# EAGLE design BadgeLedMatrix (EAGLE 7.6.0)
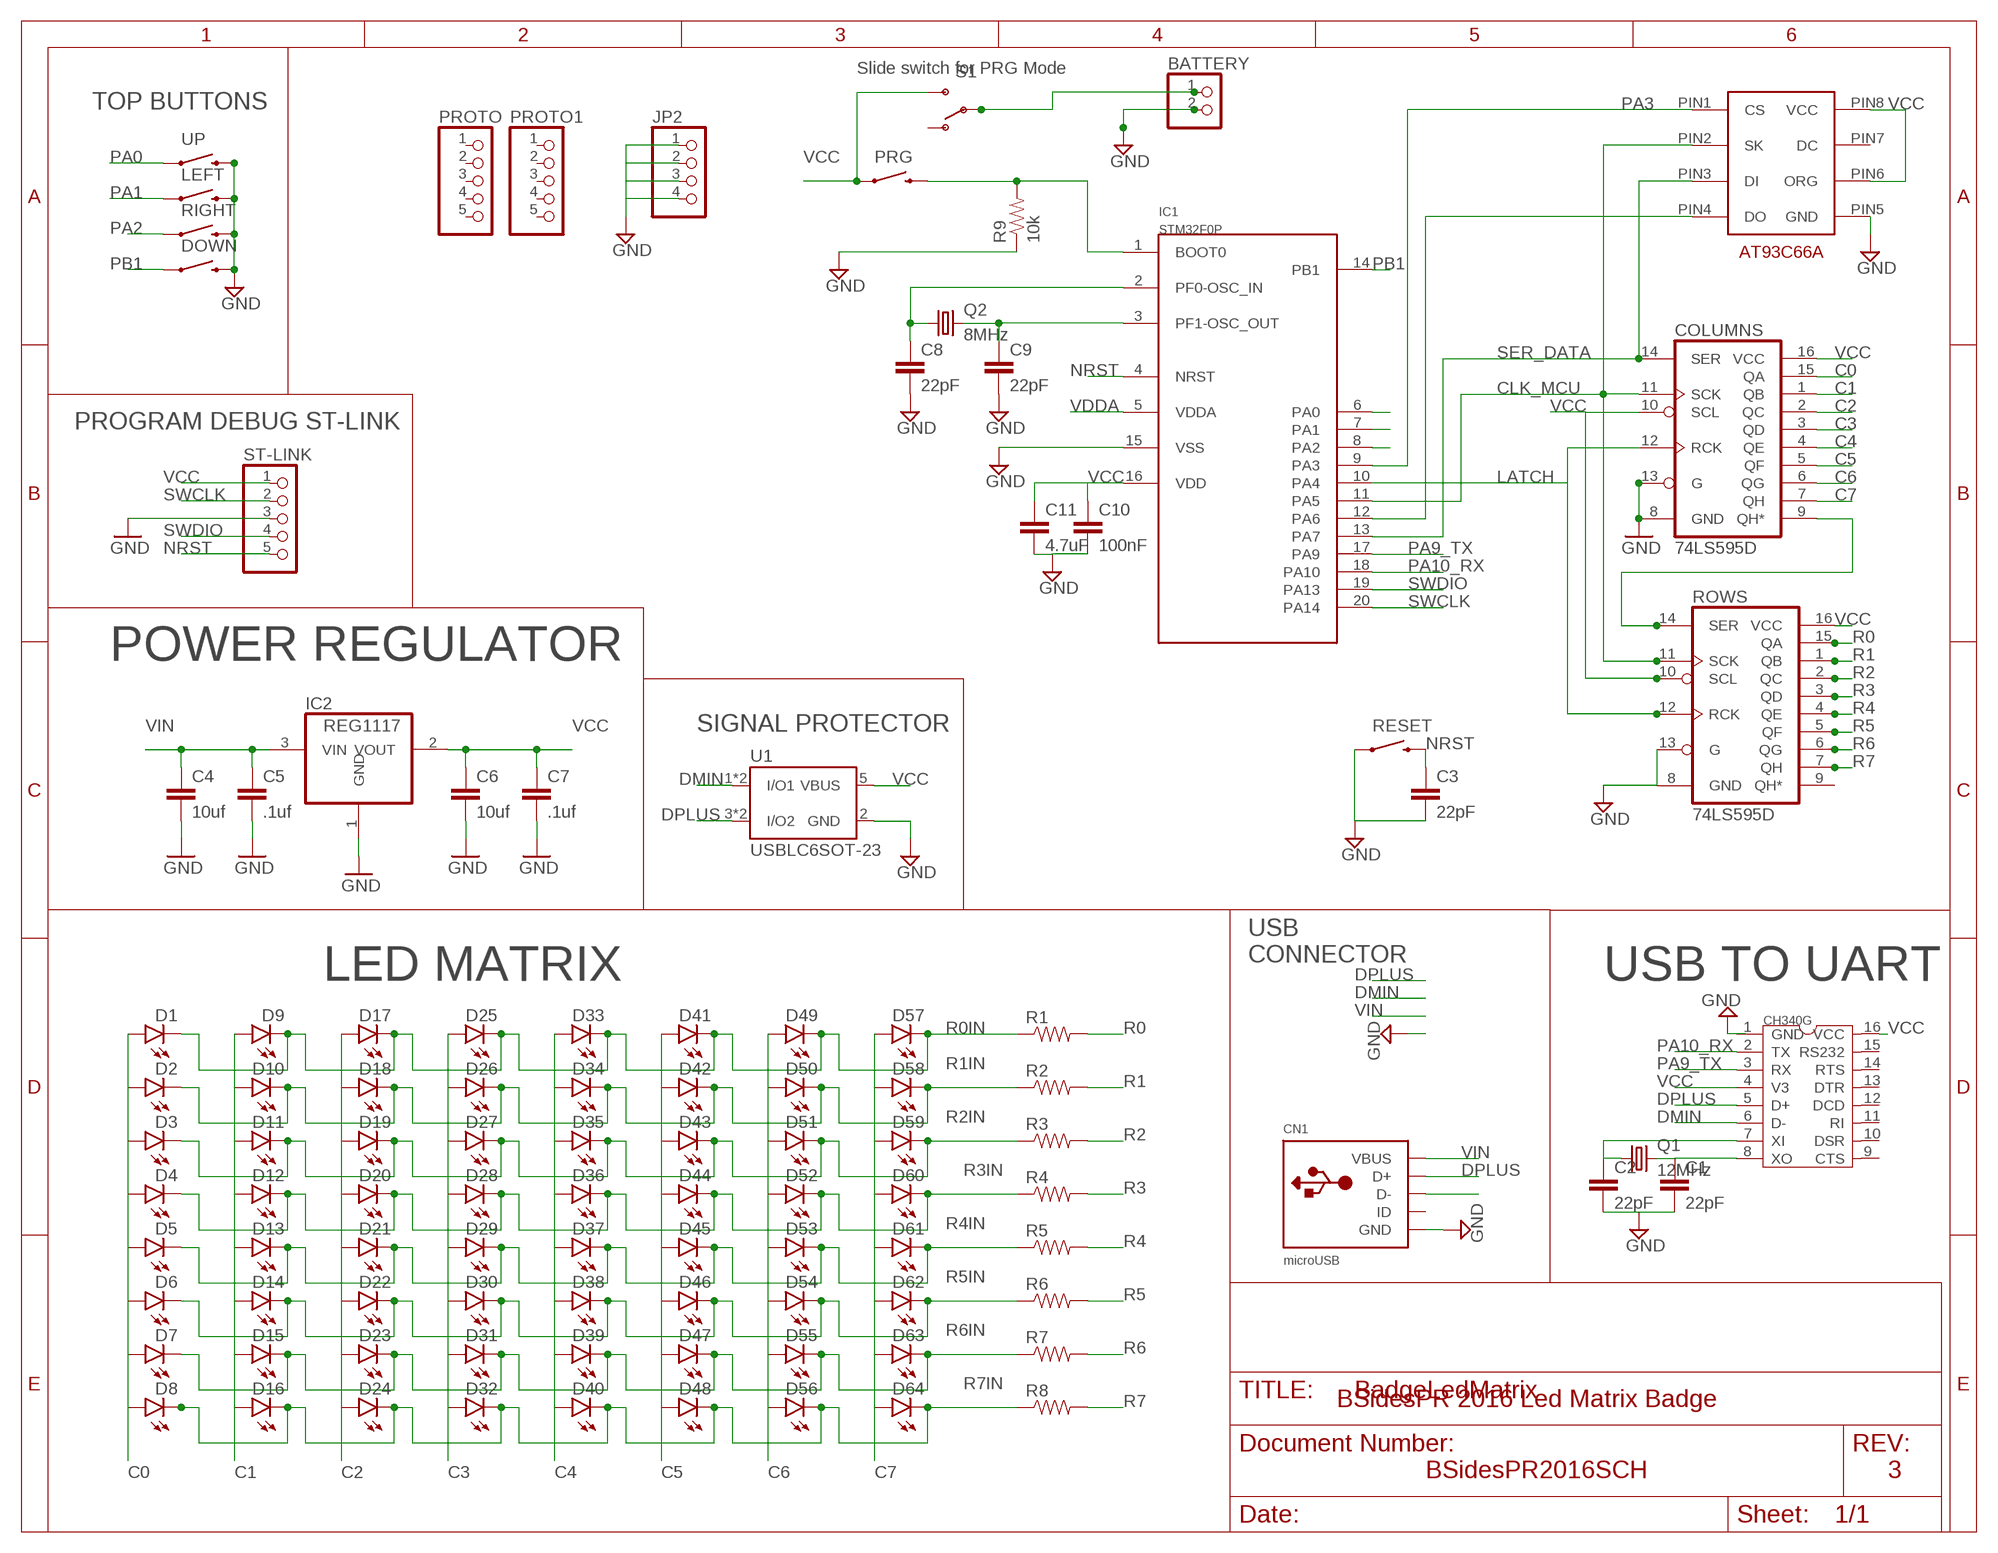
[diagram p0: schematic, sheet 1]

## Parts
BATTERY  PINHD-1X2  [1X02]
C1  22pF  CAP0603-CAP  [0603-CAP]
C2  22pF  CAP0603-CAP  [0603-CAP]
C3  22pF  CAP0603-CAP  [0603-CAP]
C4  10uf  CAP0603-CAP  [0603-CAP]
C5  .1uf  CAP0603-CAP  [0603-CAP]
C6  10uf  CAP0603-CAP  [0603-CAP]
C7  .1uf  CAP0603-CAP  [0603-CAP]
C8  22pF  CAP0603-CAP  [0603-CAP]
C9  22pF  CAP0603-CAP  [0603-CAP]
C10  100nF  CAP0603-CAP  [0603-CAP]
C11  4.7uF  CAP0603-CAP  [0603-CAP]
CH340G  CH340GCH340G  [SOP-16]
CN1  microUSB  USBMICRO_20329  [4UCONN_20329]
COLUMNS  74LS595D  [SO16]
D1  LED0603  [LED-0603]
D2  LED0603  [LED-0603]
D3  LED0603  [LED-0603]
D4  LED0603  [LED-0603]
D5  LED0603  [LED-0603]
D6  LED0603  [LED-0603]
D7  LED0603  [LED-0603]
D8  LED0603  [LED-0603]
D9  LED0603  [LED-0603]
D10  LED0603  [LED-0603]
D11  LED0603  [LED-0603]
D12  LED0603  [LED-0603]
D13  LED0603  [LED-0603]
D14  LED0603  [LED-0603]
D15  LED0603  [LED-0603]
D16  LED0603  [LED-0603]
D17  LED0603  [LED-0603]
D18  LED0603  [LED-0603]
D19  LED0603  [LED-0603]
D20  LED0603  [LED-0603]
D21  LED0603  [LED-0603]
D22  LED0603  [LED-0603]
D23  LED0603  [LED-0603]
D24  LED0603  [LED-0603]
D25  LED0603  [LED-0603]
D26  LED0603  [LED-0603]
D27  LED0603  [LED-0603]
D28  LED0603  [LED-0603]
D29  LED0603  [LED-0603]
D30  LED0603  [LED-0603]
D31  LED0603  [LED-0603]
D32  LED0603  [LED-0603]
D33  LED0603  [LED-0603]
D34  LED0603  [LED-0603]
D35  LED0603  [LED-0603]
D36  LED0603  [LED-0603]
D37  LED0603  [LED-0603]
D38  LED0603  [LED-0603]
D39  LED0603  [LED-0603]
D40  LED0603  [LED-0603]
D41  LED0603  [LED-0603]
D42  LED0603  [LED-0603]
D43  LED0603  [LED-0603]
D44  LED0603  [LED-0603]
D45  LED0603  [LED-0603]
D46  LED0603  [LED-0603]
D47  LED0603  [LED-0603]
D48  LED0603  [LED-0603]
D49  LED0603  [LED-0603]
D50  LED0603  [LED-0603]
D51  LED0603  [LED-0603]
D52  LED0603  [LED-0603]
D53  LED0603  [LED-0603]
D54  LED0603  [LED-0603]
D55  LED0603  [LED-0603]
D56  LED0603  [LED-0603]
D57  LED0603  [LED-0603]
D58  LED0603  [LED-0603]
D59  LED0603  [LED-0603]
D60  LED0603  [LED-0603]
D61  LED0603  [LED-0603]
D62  LED0603  [LED-0603]
D63  LED0603  [LED-0603]
D64  LED0603  [LED-0603]
DOWN  SWITCH-MOMENTARY-2SMD-REDUNDANT  [TACTILE-SWITCH-SMD]
IC1  STM32F0P  [TSSOP20]
IC2  REG1117  [SOT223]
JP2  PINHD-1X4  [1X04]
LEFT  SWITCH-MOMENTARY-2SMD-REDUNDANT  [TACTILE-SWITCH-SMD]
PRG  SWITCH-MOMENTARY-2SMD-REDUNDANT  [TACTILE-SWITCH-SMD]
PROTO  PINHD-1X5  [1X05]
PROTO1  PINHD-1X5  [1X05]
Q1  12MHz  CRYSTALHC49U70  [HC49U70]
Q2  8MHz  CRYSTALHC49U70  [HC49U70]
R1  RESISTOR0603-RES  [0603-RES]
R2  RESISTOR0603-RES  [0603-RES]
R3  RESISTOR0603-RES  [0603-RES]
R4  RESISTOR0603-RES  [0603-RES]
R5  RESISTOR0603-RES  [0603-RES]
R6  RESISTOR0603-RES  [0603-RES]
R7  RESISTOR0603-RES  [0603-RES]
R8  RESISTOR0603-RES  [0603-RES]
R9  10k  RESISTOR0603-RES  [0603-RES]
RESET  SWITCH-MOMENTARY-2SMD-REDUNDANT  [TACTILE-SWITCH-SMD]
RIGHT  SWITCH-MOMENTARY-2SMD-REDUNDANT  [TACTILE-SWITCH-SMD]
ROWS  74LS595D  [SO16]
S1  SWITCH-SPDT-SMD-A  [SWITCH-SPST-SMD-A]
ST-LINK  PINHD-1X5  [1X05]
U1  USBLC6SOT-23  [SOT23-6]
U$6  AT93C66A  [SOP-8]
UP  SWITCH-MOMENTARY-2SMD-REDUNDANT  [TACTILE-SWITCH-SMD]

## Nets
C0: COLUMNS.15(QA) D1.A D2.A D3.A D4.A D5.A D6.A D7.A D8.A
C1: COLUMNS.1(QB) D9.A D10.A D11.A D12.A D13.A D14.A D15.A D16.A
C2: COLUMNS.2(QC) D17.A D18.A D19.A D20.A D21.A D22.A D23.A D24.A
C3: COLUMNS.3(QD) D25.A D26.A D27.A D28.A D29.A D30.A D31.A D32.A
C4: COLUMNS.4(QE) D33.A D34.A D35.A D36.A D37.A D38.A D39.A D40.A
C5: COLUMNS.5(QF) D41.A D42.A D43.A D44.A D45.A D46.A D47.A D48.A
C6: COLUMNS.6(QG) D49.A D50.A D51.A D52.A D53.A D54.A D55.A D56.A
C7: COLUMNS.7(QH) D57.A D58.A D59.A D60.A D61.A D62.A D63.A D64.A
CLK_MCU: COLUMNS.11(SCK) IC1.11(PA5) ROWS.11(SCK) U$6.PIN2(SK)
DMIN: CH340G.6(D-) CN1.D- U1.1(I/O1) U1.4(I/O1)
DPLUS: CH340G.5(D+) CN1.D+ U1.3(I/O2) U1.6(I/O2)
GND: BATTERY.2 C1.2 C2.2 C3.2 C4.2 C5.2 C6.2 C7.2 C8.2 C9.2 C10.2 C11.2 CH340G.1(GND) CN1.BASE@1(GND) CN1.BASE@2(GND) CN1.GND CN1.SPRT@1(GND) CN1.SPRT@2(GND) CN1.SPRT@3(GND) CN1.SPRT@4(GND) COLUMNS.8(GND) COLUMNS.13(G) DOWN.3 DOWN.4 IC1.15(VSS) IC2.1(GND) JP2.1 JP2.2 JP2.3 JP2.4 LEFT.3 LEFT.4 R9.1 RESET.1 RESET.2 RIGHT.3 RIGHT.4 ROWS.8(GND) ROWS.13(G) ST-LINK.3 U1.2(GND) U$6.PIN5(GND) UP.3 UP.4
LATCH: COLUMNS.12(RCK) IC1.10(PA4) ROWS.12(RCK)
N$1: C9.1 IC1.3(PF1-OSC_OUT) Q2.2
N$2: C8.1 IC1.2(PF0-OSC_IN) Q2.1
N$4: IC1.1(BOOT0) PRG.3 PRG.4 R9.2
N$5: BATTERY.1 S1.2(P)
NRST: C3.1 IC1.4(NRST) RESET.3 RESET.4 ST-LINK.5
OVERFLOW: COLUMNS.9(QH*) ROWS.14(SER)
PA0: IC1.6(PA0) UP.1 UP.2
PA1: IC1.7(PA1) LEFT.1 LEFT.2
PA2: IC1.8(PA2) RIGHT.1 RIGHT.2
PA3: IC1.9(PA3) U$6.PIN1(CS)
PA6: IC1.12(PA6) U$6.PIN4(DO)
PA9_TX: CH340G.3(RX) IC1.17(PA9)
PA10_RX: CH340G.2(TX) IC1.18(PA10)
PB1: DOWN.1 DOWN.2 IC1.14(PB1)
R0: R1.2 ROWS.15(QA)
R0IN: D1.C D9.C D17.C D25.C D33.C D41.C D49.C D57.C R1.1
R1: R2.2 ROWS.1(QB)
R1IN: D2.C D10.C D18.C D26.C D34.C D42.C D50.C D58.C R2.1
R2: R3.2 ROWS.2(QC)
R2IN: D3.C D11.C D19.C D27.C D35.C D43.C D51.C D59.C R3.1
R3: R4.2 ROWS.3(QD)
R3IN: D4.C D12.C D20.C D28.C D36.C D44.C D52.C D60.C R4.1
R4: R5.2 ROWS.4(QE)
R4IN: D5.C D13.C D21.C D29.C D37.C D45.C D53.C D61.C R5.1
R5: R6.2 ROWS.5(QF)
R5IN: D6.C D14.C D22.C D30.C D38.C D46.C D54.C D62.C R6.1
R6: R7.2 ROWS.6(QG)
R6IN: D7.C D15.C D23.C D31.C D39.C D47.C D55.C D63.C R7.1
R7: R8.2 ROWS.7(QH)
R7IN: D8.C D16.C D24.C D32.C D40.C D48.C D56.C D64.C R8.1
SER_DATA: COLUMNS.14(SER) IC1.13(PA7) U$6.PIN3(DI)
SWCLK: IC1.20(PA14) ST-LINK.2
SWDIO: IC1.19(PA13) ST-LINK.4
VCC: C6.1 C7.1 C10.1 C11.1 CH340G.4(V3) CH340G.16(VCC) COLUMNS.10(SCL) COLUMNS.16(VCC) IC1.16(VDD) IC2.2(VOUT) PRG.1 PRG.2 ROWS.10(SCL) ROWS.16(VCC) S1.3(S) ST-LINK.1 U1.5(VBUS) U$6.PIN6(ORG) U$6.PIN8(VCC)
VDDA: IC1.5(VDDA)
VIN: C4.1 C5.1 CN1.VBUS IC2.3(VIN)
XI: C2.1 CH340G.7(XI) Q1.1
XO: C1.1 CH340G.8(XO) Q1.2
Unconnected: CH340G.9(CTS) CH340G.10(DSR) CH340G.11(RI) CH340G.12(DCD) CH340G.13(DTR) CH340G.14(RTS) CH340G.15(RS232) CN1.ID PROTO1.1 PROTO1.2 PROTO1.3 PROTO1.4 PROTO1.5 PROTO.1 PROTO.2 PROTO.3 PROTO.4 PROTO.5 ROWS.9(QH*) S1.1(O) U$6.PIN7(DC)

## Notes on the sheet
- Slide switch for PRG Mode
- TOP BUTTONS
- PROGRAM DEBUG ST-LINK
- POWER REGULATOR
- SIGNAL PROTECTOR
- USB
  CONNECTOR
- LED MATRIX | USB TO UART
- BSidesPR 2016 Led Matrix Badge
- BSidesPR2016SCH | 3

## Library data of the parts
BATTERY = pinhead:PINHD-1X2: PIN HEADER
C1-C3 C8-C11 = SparkFun-Capacitors:CAP: Capacitor Standard 0603 ceramic capacitor, and 0.1" leaded capacitor.
C4-C7 = SparkFun-Passives:CAP: Capacitor Standard 0603 ceramic capacitor, and 0.1" leaded capacitor.
CH340G = digital-ic:CH340G: USB to Serial CH340G
CN1 = microbuilder:USB: USB Connectors USBMINIB - Surface Mount Female Mini-B USB Connector 4UConnector: 06564
COLUMNS ROWS = SparkFun-DigitalIC:74*595: 8-bit SHIFT REGISTER, output latch; PROD_ID: IC-07875
D1-D64 = SparkFun-LED:LED: LEDs Standard schematic elements and footprints for 5mm, 3mm, 1206, and 0603 sized LEDs. 5mm - Spark Fun Electronics SKU : COM-00529 (and others)
DOWN LEFT PRG RESET RIGHT UP = SparkFun-Electromechanical:SWITCH-MOMENTARY-2: Various NO switches- pushbuttons, reed, etc
IC1 = digital-ic:STM32F0*: STM32F0
IC2 = burr-brown:REG1117: 800mA and 1A Low Dropout (LDO) Positive Regulator 1.8V, 2.5V, 2.85V, 3.3V, 5V, and Adj; MPN: REG1117; OC_FARNELL: 1097566; OC_NEWARK: 14P6981
JP2 = pinhead:PINHD-1X4: PIN HEADER
PROTO PROTO1 ST-LINK = pinhead:PINHD-1X5: PIN HEADER
Q1 Q2 = crystal:CRYSTAL: CRYSTAL; OC_FARNELL: unknown; OC_NEWARK: unknown
R1-R9 = SparkFun-Passives:RESISTOR: Resistor Basic schematic elements and footprints for 0603, 1206, and PTH resistors.
S1 = SparkFun-Electromechanical:SWITCH-SPDT: SPDT Switch Simple slide switch, Spark Fun Electronics SKU : COM-00102 DPDT SMT slide switch, AYZ0202, SWCH-08179
U1 = digital-ic:USBLC6: USBLC6-2SC6 TVS Diode 5.25VWM 17VC , SOT23-6
U$6 = digital-ic:AT93C66A

## Board
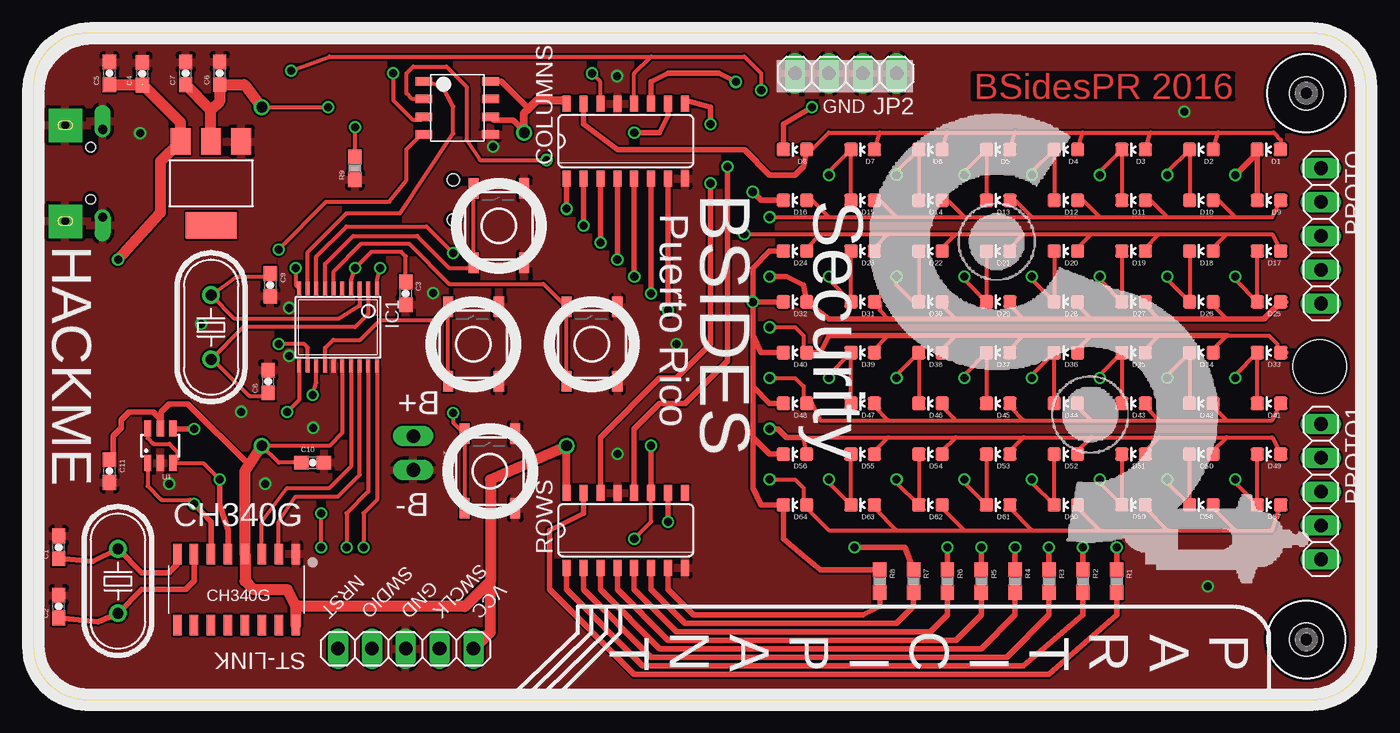
[diagram p1: board, top side]
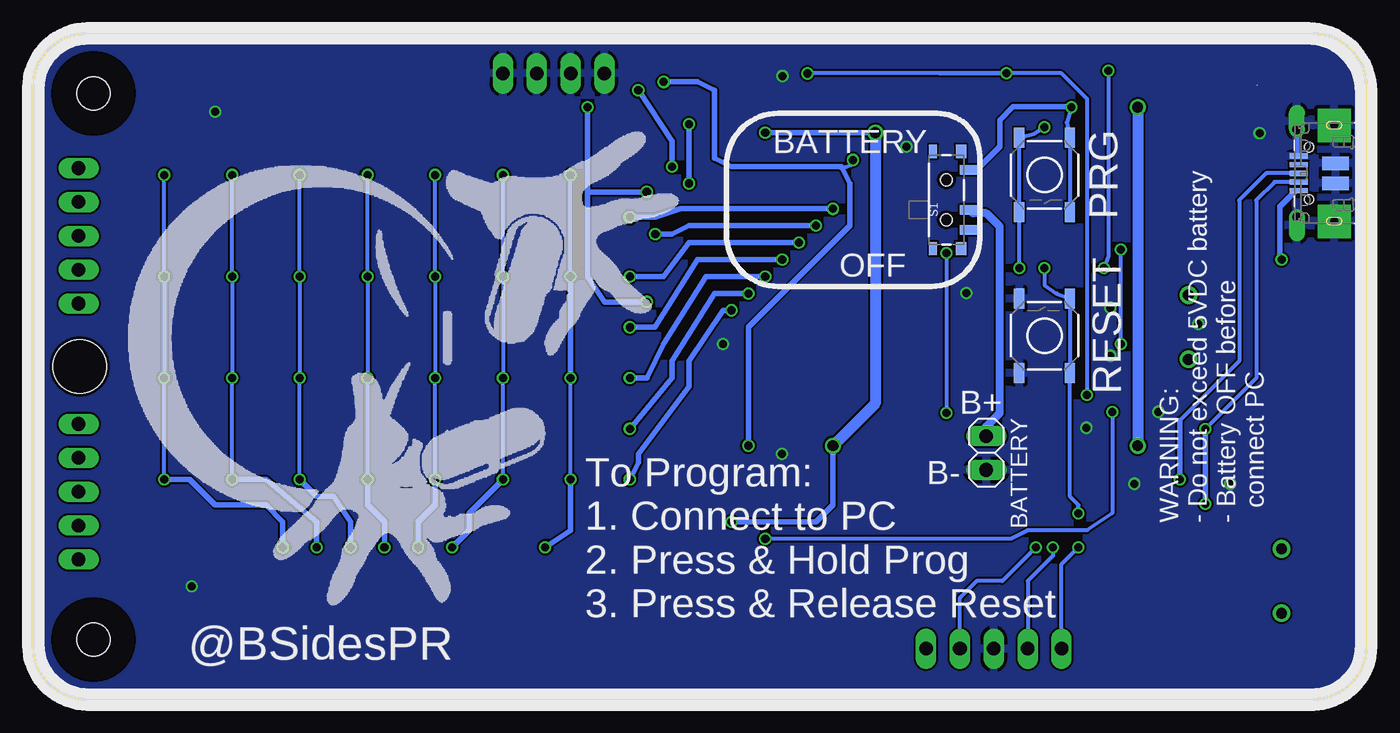
[diagram p2: board, bottom side, seen from below]

Size 100 x 50 mm. Coordinates in mm from the lower left corner, seen from the top.
Outline: 100,46 arc90 96,50 4,50 arc90 0,46 0,4 arc90 4,0 96,0 arc90 100,4 100,46
Copper layers (1*16): Top 0.035mm / dielectric 1.5mm / Bottom 0.035mm
Design rules "SeeedStudio_2layer_DRU_no_angle_20140221": minimum track width 6mil, minimum drill 12mil, track to track 6mil, track to pad 6mil, pad to pad 6mil, via to via 6mil, smd to smd 0mil, copper to edge 10mil, drill to drill 10mil, minimum pad ring 10mil, minimum via ring 6mil, stop-mask expansion 2mil, vias tented up to drill 100mil, thermal gap 10mil
Holes 4 mm at 96.52,25

### Footprints (pad centres in the part's own frame; a part is rotated, then mirrored left to right if it is on the bottom)
1X02 = drill 1.016 long: 1 -1.27,0; 2 1.27,0
0603-CAP = smd 1.1 x 1: 1 -0.85,0; 2 0.85,0
SOP-16 = smd 0.635 x 1.524: 1 -4.445,-2.667; 2 -3.175,-2.667; 3 -1.905,-2.667; 4 -0.635,-2.667; 5 0.635,-2.667; 6 1.905,-2.667; 7 3.175,-2.667; 8 4.445,-2.667; 9 4.445,2.667; 10 3.175,2.667; 11 1.905,2.667; 12 0.635,2.667; 13 -0.635,2.667; 14 -1.905,2.667; 15 -3.175,2.667; 16 -4.445,2.667
4UCONN_20329 = smd 1 x 2: BASE@1 -0.75,-2; BASE@2 0.75,-2 | smd 0.4 x 1.35: D+ 0,0.775; D- -0.65,0.775; GND 1.3,0.775; ID 0.65,0.775; VBUS -1.3,0.775 | drill 0.7 offset: SPRT@1 -3.3,0.9; SPRT@2 3.3,0.9 | drill 0.6 pad 2.5 square: SPRT@3 -3.6,-1.9; SPRT@4 3.6,-1.9 | hole 0.7: -1.95,0; 1.95,0
SO16 = smd 0.6 x 1.2: 1 -4.445,-2.8; 2 -3.175,-2.8; 3 -1.905,-2.8; 4 -0.635,-2.8; 5 0.635,-2.8; 6 1.905,-2.8; 7 3.175,-2.8; 8 4.445,-2.8; 9 4.445,2.8; 10 3.175,2.8; 11 1.905,2.8; 12 0.635,2.8; 13 -0.635,2.8; 14 -1.905,2.8; 15 -3.175,2.8; 16 -4.445,2.8
LED-0603 = smd 1 x 1: A 0,-0.877; C 0,0.877
TACTILE-SWITCH-SMD = smd 1.524 x 0.762: 1 -2.794,1.905; 2 2.794,1.905; 3 -2.794,-1.905; 4 2.794,-1.905
TSSOP20 = smd 0.305 x 0.991: 1 -2.925,-2.918; 2 -2.275,-2.918; 3 -1.625,-2.918; 4 -0.975,-2.918; 5 -0.325,-2.918; 6 0.325,-2.918; 7 0.975,-2.918; 8 1.625,-2.918; 9 2.275,-2.918; 10 2.925,-2.918; 11 2.925,2.918; 12 2.275,2.918; 13 1.625,2.918; 14 0.975,2.918; 15 0.325,2.918; 16 -0.325,2.918; 17 -0.975,2.918; 18 -1.625,2.918; 19 -2.275,2.918; 20 -2.925,2.918
SOT223 = smd 1.499 x 2.007: 1 -2.261,-3.15; 2 0.025,-3.15; 3 2.311,-3.15 | smd 3.81 x 2.007: 4 0,3.15
1X04 = drill 1.016 long: 1 -3.81,0; 2 -1.27,0; 3 1.27,0; 4 3.81,0
1X05 = drill 1.016 long: 1 -5.08,0; 2 -2.54,0; 3 0,0; 4 2.54,0; 5 5.08,0
HC49U70 = drill 0.813: 1 -2.413,0; 2 2.413,0
0603-RES = smd 1.1 x 1: 1 -0.85,0; 2 0.85,0
SWITCH-SPST-SMD-A = smd 0.7 x 1.5: 1 -2.25,-1.75; 2 -0.75,-1.75; 3 2.25,-1.75 | smd 1 x 0.6: GND1 -3.65,1; GND3 3.65,1 | smd 1 x 0.8: GND2 -3.65,-1.1; GND4 3.65,-1.1 | hole 0.9: -1.5,0; 1.5,0
SOT23-6 = smd 0.55 x 1.2: 1 0.95,1.3; 2 0,1.3; 3 -0.95,1.3; 4 -0.95,-1.3; 5 0,-1.3; 6 0.95,-1.3
DRIL-2,5 = hole 2.5: 0,0
SOP-8 = smd 1.27 x 0.635: PIN1 -2.5,2; PIN2 -2.5,0.67; PIN3 -2.5,-0.67; PIN4 -2.5,-2; PIN5 2.5,-2; PIN6 2.5,-0.67; PIN7 2.5,0.67; PIN8 2.5,2

### Placement (x,y rotation side)
BATTERY  28.5,18.5 270 bottom
C1  1.91,11.43 90 top
C2  1.91,6.99 90 top
C3  27.94,30.48 270 top
C4  8.18,46.96 90 top
C5  5.71,46.99 90 top
C6  13.99,47.01 90 top
C7  11.43,46.99 90 top
C8  17.62,23.87 90 top
C9  17.78,31.11 270 top
C10  20.95,17.78 0 top
C11  5.71,17.14 270 top
CH340G  15.24,8.26 180 top
CN1  4.3,39.5 90 bottom
COLUMNS  44.45,41.91 0 top
D1  92.69,41.27 90 top
D2  87.63,41.27 90 top
D3  82.55,41.27 90 top
D4  77.47,41.27 90 top
D5  72.39,41.27 90 top
D6  67.31,41.27 90 top
D7  62.23,41.27 90 top
D8  57.15,41.27 90 top
D9  92.71,37.47 90 top
D10  87.63,37.47 90 top
D11  82.55,37.47 90 top
D12  77.47,37.47 90 top
D13  72.39,37.47 90 top
D14  67.31,37.47 90 top
D15  62.23,37.47 90 top
D16  57.15,37.47 90 top
D17  92.71,33.66 90 top
D18  87.63,33.66 90 top
D19  82.55,33.66 90 top
D20  77.47,33.66 90 top
D21  72.39,33.66 90 top
D22  67.31,33.66 90 top
D23  62.23,33.66 90 top
D24  57.15,33.66 90 top
D25  92.71,29.84 90 top
D26  87.63,29.84 90 top
D27  82.55,29.84 90 top
D28  77.47,29.84 90 top
D29  72.39,29.84 90 top
D30  67.31,29.84 90 top
D31  62.23,29.84 90 top
D32  57.15,29.84 90 top
D33  92.71,26.04 90 top
D34  87.63,26.04 90 top
D35  82.55,26.04 90 top
D36  77.47,26.04 90 top
D37  72.39,26.04 90 top
D38  67.31,26.04 90 top
D39  62.23,26.04 90 top
D40  57.15,26.04 90 top
D41  92.71,22.23 90 top
D42  87.63,22.23 90 top
D43  82.55,22.23 90 top
D44  77.47,22.23 90 top
D45  72.39,22.23 90 top
D46  67.31,22.23 90 top
D47  62.23,22.23 90 top
D48  57.15,22.23 90 top
D49  92.71,18.41 90 top
D50  87.63,18.41 90 top
D51  82.55,18.41 90 top
D52  77.47,18.41 90 top
D53  72.39,18.41 90 top
D54  67.31,18.41 90 top
D55  62.23,18.41 90 top
D56  57.15,18.41 90 top
D57  92.71,14.61 90 top
D58  87.63,14.61 90 top
D59  82.55,14.61 90 top
D60  77.47,14.61 90 top
D61  72.39,14.61 90 top
D62  67.31,14.61 90 top
D63  62.23,14.61 90 top
D64  57.15,14.61 90 top
DOWN  33.02,26.67 90 top
IC1  22.86,27.94 180 top
IC2  13.35,38.73 180 top
JP2  60.96,46.99 180 top
LEFT  34.92,35.56 90 top
PRG  24.13,39.37 270 bottom
PROTO  96.6,34.8 270 top
PROTO1  96.6,15.6 270 top
Q1  6.35,8.89 90 top
Q2  13.34,27.94 90 top
R1  81.28,8.89 270 top
R2  78.74,8.89 270 top
R3  76.2,8.89 270 top
R4  73.66,8.89 270 top
R5  71.12,8.89 270 top
R6  68.58,8.89 270 top
R7  66.04,8.89 270 top
R8  63.5,8.89 270 top
R9  24.13,39.87 90 top
RESET  24.13,27.3 90 bottom
RIGHT  34.25,17.14 90 top
ROWS  44.45,12.7 0 top
S1  31.5,37.5 90 bottom
ST-LINK  27.94,3.81 180 top
U1  9.53,19.05 180 top
U$1  [OBSIDISLOGO_BOTTOM]  51.6,42.6 270 top
U$2  [BSIDES_LOGO_NTB_PIC_ONLY]  63.96,41.41 270 top
U$3  [DRIL-2,5]  95.5,4.5 0 top
U$5  [DRIL-2,5]  95.5,45.5 0 top
U$6  31.8,44.4 0 top
UP  41.91,26.67 90 top

### Tracks (layer width: path | path; a pad name or v marks a point on that pad's centre or on a via)
C0
  Top 0.305: D8.A 58.42,41.27 59.69,42.55 63.5,42.55 | 63.5,42.55 68.58,42.55 | 68.58,42.55 73.66,42.55 | 73.66,42.55 78.74,42.55 | 78.74,42.55 83.82,42.55 | 83.82,42.55 88.9,42.55 | D3.A 83.82,42.55 | D7.A 63.5,42.55 | D6.A 68.58,42.55 | D5.A 73.66,42.55 | D4.A 78.74,42.55 | D2.A 88.9,42.55 | 88.9,42.55 93.06,42.55 93.6,42 93.6,41.31 D1.A
  Top 0.406: D8.A 57.78,40.01 57.15,39.37 55.24,39.37 53.34,41.27 43.81,41.27 41.27,43.18 COLUMNS.15
C1  (via drill 0.61)
  Top 0.305: 59.69,36.2 58.42,36.2 v55.24,36.2 | 59.69,36.2 64.77,36.2 | 64.77,36.2 69.85,36.2 | 69.85,36.2 74.93,36.2 | 74.93,36.2 80.01,36.2 | 80.01,36.2 85.09,36.2 | 85.09,36.2 90.17,36.2 | 90.17,36.2 92.95,36.2 D9.A | D15.A 63.5,37.47 64.77,36.2 | D14.A 68.58,37.47 69.85,36.2 | D13.A 73.66,37.47 74.93,36.2 | D12.A 78.74,37.47 80.01,36.2 | D11.A 83.82,37.47 85.09,36.2 | D10.A 88.9,37.47 90.17,36.2 | D16.A 58.42,37.47 59.69,36.2
  Top 0.406: v40.01,36.83 COLUMNS.1
  Bottom 0.406: v40.01,36.83 51.44,36.83 53.34,36.2 v55.24,36.2
C2  (via drill 0.61)
  Top 0.305: D17.A 92.95,34.92 89.53,34.92 | 79.38,34.92 84.45,34.92 | 84.45,34.92 89.53,34.92 | 59.05,34.92 58.42,34.92 v53.34,34.92 | 59.05,34.92 64.14,34.92 | 64.14,34.92 69.22,34.92 | 69.22,34.92 74.3,34.92 | 74.3,34.92 79.38,34.92 | D20.A 78.35,33.9 79.38,34.92 | D19.A 83.43,33.9 84.45,34.92 | D18.A 88.51,33.9 89.53,34.92 | D23.A 63.11,33.9 64.14,34.92 | D22.A 68.19,33.9 69.22,34.92 | D21.A 73.27,33.9 74.3,34.92 | D24.A 58.03,33.9 59.05,34.92
  Top 0.406: v41.27,35.56 COLUMNS.2
  Bottom 0.406: v41.27,35.56 50.8,35.56 52.07,34.92 v53.34,34.92
C3  (via drill 0.61)
  Top 0.305: D31.A 63.5,29.84 63.5,29.21 64.14,28.57 | 68.58,29.84 D30.A 68.19,29.6 69.22,28.57 | D29.A 73.27,29.6 74.3,28.57 | D28.A 78.35,29.6 79.38,28.57 | D27.A 83.43,29.6 84.45,28.57 | D26.A 88.51,29.6 89.53,28.57
  Top 0.406: v55.24,31.75 56.52,31.75 57.78,31.11 D32.A 59.69,28.57 64.14,28.57 69.22,28.57 74.3,28.57 79.38,28.57 84.45,28.57 89.53,28.57 92.32,28.57 D25.A 93.98,29.84 | v42.55,34.29 COLUMNS.3
  Bottom 0.406: v42.55,34.29 50.8,34.29 52.7,31.75 v55.24,31.75
C4  (via drill 0.61)
  Top 0.305: D39.A 63.11,26.28 64.14,27.3 | D38.A 68.19,26.28 69.22,27.3 | D37.A 73.27,26.28 74.3,27.3 | D36.A 78.35,26.28 79.38,27.3 | D35.A 83.43,26.28 84.45,27.3 | D34.A 88.51,26.28 89.53,27.3 92.71,27.3 93.34,26.67 93.34,26.28 D33.A | v55.24,27.94 57.15,27.94 57.78,27.3 57.78,26.28 D40.A
  Top 0.406: D40.A 59.05,26.04 59.69,27.3 64.14,27.3 69.22,27.3 74.3,27.3 79.38,27.3 84.45,27.3 89.53,27.3 | D33.A 93.98,26.04 | v43.81,33.02 COLUMNS.4
  Bottom 0.406: v43.81,33.02 50.16,33.02 53.34,27.94 v55.24,27.94
C5  (via drill 0.61)
  Top 0.305: 64.14,20.95 59.05,20.95 58.42,22.23 D48.A 57.78,22.47 57.78,23.5 57.15,24.13 v55.24,24.13 | 64.14,20.95 69.22,20.95 | 69.22,20.95 74.3,20.95 | 74.3,20.95 79.38,20.95 | 79.38,20.95 84.45,20.95 | 84.45,20.95 89.53,20.95 | 89.53,20.95 92.95,20.95 D41.A | D47.A 63.11,21.98 64.14,20.95 | D46.A 68.19,21.98 69.22,20.95 | D45.A 73.27,21.98 74.3,20.95 | D44.A 78.35,21.98 79.38,20.95 | D43.A 83.43,21.98 84.45,20.95 | D42.A 88.51,21.98 89.53,20.95
  Top 0.406: v45.09,31.75 COLUMNS.5
  Bottom 0.406: v45.09,31.75 49.53,31.75 52.7,26.67 53.98,24.13 v55.24,24.13
C6  (via drill 0.61)
  Top 0.305: D56.A 57.78,19.68 64.14,19.68 | 64.14,19.68 69.22,19.68 | 69.22,19.68 74.3,19.68 | 74.3,19.68 79.38,19.68 | 79.38,19.68 84.45,19.68 | 84.45,19.68 89.53,19.68 | 89.53,19.68 92.95,19.68 D49.A | D55.A 63.11,18.66 64.14,19.68 | D54.A 68.19,18.66 69.22,19.68 | D53.A 73.27,18.66 74.3,19.68 | D52.A 78.35,18.66 79.38,19.68 | D51.A 83.43,18.66 84.45,19.68 | D50.A 88.51,18.66 89.53,19.68
  Top 0.406: v55.24,20.32 55.88,20.32 56.52,19.68 57.78,19.68 | v46.35,30.48 COLUMNS.6
  Bottom 0.406: v46.35,30.48 48.9,30.48 52.07,25.4 52.07,24.13 v55.24,20.32
C7  (via drill 0.61)
  Top 0.305: 64.77,12.7 69.85,12.7 | 69.85,12.7 74.93,12.7 | 74.93,12.7 80.01,12.7 | 80.01,12.7 85.09,12.7 | 85.09,12.7 90.17,12.7 | 90.17,12.7 92.95,12.7 D57.A | D63.A 63.11,14.36 64.77,12.7 | D62.A 68.19,14.36 69.85,12.7 | D61.A 73.27,14.36 74.93,12.7 | D60.A 78.35,14.36 80.01,12.7 | D59.A 83.43,14.36 85.09,12.7 | D58.A 88.51,14.36 90.17,12.7 | v55.24,16.51 57.15,16.51 57.78,15.88 57.78,14.61 59.69,12.7 64.77,12.7
  Top 0.406: D64.A 57.78,14.61 | v47.62,29.21 COLUMNS.7
  Bottom 0.406: v47.62,29.21 48.26,29.21 50.8,25.4 50.8,23.5 54.61,18.41 54.61,17.78 v55.24,16.51
CLK_MCU  (via drill 0.6, 0.61, 0.61 pad 0.61)
  Top 0.305: v45.09,12.06 46.35,13.34 46.35,15.88 | IC1.11 19.93,22.48 v19.05,21.59 | U$6.PIN2 28.43,45.07 28,45.5 28,47 28.5,47.5 31,47.5 32.5,46 32.5,42 33.5,40.5 v38.5,40.5
  Top 0.406: v52.7,46.35 51.44,46.99 47.62,46.99 46.35,46.35 COLUMNS.11 | ROWS.11 46.35,15.88 v46.35,19.05
  Bottom 0.305: v19.05,21.59 19.05,13.97 20.95,12.7 25.4,12.7 26.67,12.06 v45.09,12.06 | v38.5,40.5 38.5,40.15 39.29,39.85
  Bottom 0.406: v52.7,46.35 50.16,46.35 48.9,45.72 48.9,40.64 47.62,40.01 39.37,40.01 39.29,39.85 38.73,38.73 38.73,35.56 46.35,27.94 v46.35,19.05
DMIN  (via drill 0.6, 0.61 pad 0.61)
  Top 0.305: U1.1 8.57,16.02 9.6,15 11.74,15 v12.06,14.68
  Top 0.406: v12.06,14.68 13.34,13.34 CH340G.6 | U1.4 10.51,20.32 v12.06,20.32
  Bottom 0.305: CN1.D- 6.87,38.85 8.26,37.47 8.26,24.13 v12.06,20.32
  Bottom 0.406: v12.06,20.32 v12.06,14.68
DPLUS  (via drill 0.61 pad 0.61)
  Top 0.305: v13.97,16.51 12.73,17.75 U1.3 10.8,18.07 10.8,18.6 10.2,19.2 9,19.2 8.57,19.62 U1.6
  Top 0.406: v13.97,16.51 13.97,14.61 14.61,12.7 CH340G.5
  Bottom 0.305: CN1.D+ 7.49,39.5 9.53,37.47 9.53,25.4 13.97,20.95
  Bottom 0.406: 13.97,20.95 v13.97,16.51
GND  (via drill 0.6)
  Bottom 0.406: CN1.SPRT@2 5.2,40.92 CN1.GND
  other vias: 48.26,26.67 86.36,44.13 88.12,8.5 43.81,18.41 21,20.4 12.6,28.2 17.4,16.2 15.6,21.6 19.2,25.8 19.2,29.4 10.2,16.2 43.8,46.8 34.5,41.5 30,30.5 8,42.5
  pour Top: 0,0 100.33,0 100.33,50.8 0,50.8 0,48.9
  pour Bottom: 0,0 0,50.8 99.69,50.8 99.69,12.7 99.69,0
LATCH  (via drill 0.6, 0.61 pad 0.61)
  Top 0.305: 46.35,48.26 22.23,48.26 v19.34,47.2 | 46.35,48.26 53.34,48.26 54.61,46.99 v54.61,45.72 | COLUMNS.12 45.09,46.99 46.35,48.26 | v19.68,32.38 19.68,31.11 IC1.10
  Top 0.406: ROWS.12 45.09,20.32 46.99,22.23 48.9,22.23 52.07,25.4 v52.07,40.01
  Bottom 0.305: v19.34,47.2 19.34,33.27 v19.68,32.38
  Bottom 0.406: v52.07,40.01 52.07,41.91 v54.61,45.72
N$1
  Top 0.305: IC1.3 24.48,29.57 22.86,28.57 15.11,28.57 Q2.2 15.24,31.75 17.57,31.75 C9.1
N$2
  Top 0.305: IC1.2 25.14,28.95 24.13,27.94 15.75,27.94 Q2.1 13.47,25.53 16.2,22.8 17.4,22.8 C8.1
N$4  (via drill 0.6)
  Top 0.305: IC1.1 25.79,31.5 v26.04,32.38 | R9.2 v24.13,42.95
  Bottom 0.305: v26.04,32.38 PRG.4 PRG.3 26.04,42.18 24.9,42.45 v24.13,42.95
  Bottom 0.406: 26.21,36.75 PRG.4
N$5
  Bottom 0.61: BATTERY.1 28.5,20.5 27.5,21.5 27.5,35.5 28.5,36.5 29.5,36.5 S1.2
NRST  (via drill 0.6)
  Top 0.305: IC1.4 23.84,31.45 v24.13,32.38 25.34,33.6 27.6,33.6 27.94,33.26 C3.1 | v21.59,11.43 v21.59,13.97
  Bottom 0.305: v24.13,32.38 24.13,31.11 23.24,30.48 RESET.4 RESET.3 22.23,15.24 21.59,14.61 v21.59,13.97 | ST-LINK.5 22.86,10.16 v21.59,11.43
OVERFLOW  (via drill 0.61 pad 0.61)
  Top 0.406: v50.8,43.18 50.8,44.45 48.9,44.98 COLUMNS.9 | ROWS.14 42.55,19.68 46.99,24.13 48.26,24.13 50.8,26.67 v50.8,38.73
  Bottom 0.406: v50.8,43.18 v50.8,38.73
PA0
  Top 0.305: UP.1 UP.2 38.27,31.2 31.2,31.2 28.2,34.2 24.6,34.2 22.54,32.13 IC1.6
PA1
  Top 0.305: IC1.7 21.89,32.69 24,34.8 28.8,34.8 31.2,32.4 32.65,32.4 LEFT.1 LEFT.2
PA2  (via drill 0.6)
  Top 0.305: IC1.8 21.23,33.23 23.5,35.5 29.5,35.5 v31.5,33.5 | v31.5,21.5 31.5,20.78 RIGHT.2 RIGHT.1
  Bottom 0.305: v31.5,33.5 v31.5,21.5
PA3
  Top 0.305: IC1.9 20.59,33.59 23.5,36.5 27.5,36.5 31.5,42.5 31.5,44.5 30.7,46 U$6.PIN1
PA6  (via drill 0.6)
  Top 0.305: IC1.12 20.59,26.41 20.32,26.67 v18.41,26.67 | v18.41,33.76 21.95,37.35 26.7,37.35 28,39 28,41.3 29.2,42.5 U$6.PIN4
  Bottom 0.305: v18.41,26.67 v18.41,33.76
PA9_TX
  Top 0.305: CH340G.3 17.14,13.34 19.05,15.88 22.23,15.88 23.84,17.48 IC1.17
PA10_RX
  Top 0.305: CH340G.2 18.41,13.34 19.68,15.24 22.86,15.24 24.48,16.86 IC1.18
PB1
  Top 0.305: IC1.14 21.89,26.39 22.5,27 24.5,27 26,28.5 30.15,28.5 DOWN.2 DOWN.1
R0
  Top 0.406: R1.2 81.28,6.35 76.2,1.91 45.09,1.91 38.73,8.26 38.73,12.7 41.27,13.97 ROWS.15
R0IN  (via drill 0.61)
  Top 0.305: D49.C D57.C 90.17,16.27 v90.17,16.51 | D41.C D33.C 90.17,24.37 v90.17,24.13 | D17.C D25.C 90.17,31.51 v90.17,31.75
  Top 0.406: R1.1 v81.28,11.43 | v90.17,39.37 91.81,41.01 D1.C 91.83,41.26 D9.C
  Bottom 0.305: v90.17,16.51 v90.17,24.13 v90.17,31.75 v90.17,39.37
  Bottom 0.406: v81.28,11.43 81.28,13.34 82.55,14.61 86.36,14.61 88.27,16.51 v90.17,16.51
R1
  Top 0.406: R2.2 78.74,6.35 74.3,2.54 45.72,2.54 40.01,8.26 ROWS.1
R1IN  (via drill 0.61)
  Top 0.305: D10.C D2.C 85.09,39.61 v85.09,39.37 | D18.C D26.C 85.09,31.51 v85.09,31.75 | D42.C D34.C 85.09,24.37 v85.09,24.13 | D50.C D58.C 85.09,16.27 v85.09,16.51
  Top 0.406: R2.1 v78.74,11.43
  Bottom 0.305: v85.09,16.51 v85.09,24.13 v85.09,31.75 v85.09,39.37
  Bottom 0.406: v85.09,16.51 82.55,16.51 78.74,13.34 v78.74,11.43
R2
  Top 0.406: R3.2 76.2,6.35 73.03,3.17 46.35,3.17 41.27,8.26 ROWS.2
R2IN  (via drill 0.61)
  Top 0.305: D11.C D3.C 80.01,39.61 v80.01,39.37 | D19.C D27.C 80.01,31.51 v80.01,31.75 | D43.C D35.C 80.01,24.37 v80.01,24.13 | D51.C D59.C 80.01,16.27 v80.01,16.51
  Top 0.406: R3.1 v76.2,11.43
  Bottom 0.305: v80.01,16.51 v80.01,24.13 v80.01,31.75 v80.01,39.37
  Bottom 0.406: v76.2,11.43 76.2,13.34 77.47,15.24 78.74,15.24 v80.01,16.51
R3
  Top 0.406: R4.2 73.66,6.35 71.12,3.81 46.99,3.81 42.55,8.26 ROWS.3
R3IN  (via drill 0.61)
  Top 0.305: D12.C D4.C 74.93,39.61 v74.93,39.37 | D20.C D28.C 74.93,31.51 v74.93,31.75 | D52.C D60.C 74.93,16.27 v74.93,16.51 | D44.C D36.C 74.93,24.37 v74.93,24.13
  Top 0.406: R4.1 v73.66,11.43
  Bottom 0.305: v74.93,16.51 v74.93,24.13 v74.93,31.75 v74.93,39.37
  Bottom 0.406: v73.66,11.43 73.66,13.34 74.93,14.61 v74.93,16.51
R4
  Top 0.406: R5.2 71.12,6.35 69.22,4.45 47.62,4.45 43.81,8.26 ROWS.4
R4IN  (via drill 0.61)
  Top 0.305: D13.C D5.C 69.85,39.61 v69.85,39.37 | D21.C D29.C 69.85,31.51 v69.85,31.75 | D45.C D37.C 69.85,24.37 v69.85,24.13 | D53.C D61.C 69.85,16.27 v69.85,16.51
  Top 0.406: R5.1 v71.12,11.43
  Bottom 0.305: v69.85,16.51 v69.85,24.13 v69.85,31.75 v69.85,39.37
  Bottom 0.406: v71.12,11.43 71.12,13.34 69.85,14.61 v69.85,16.51
R5
  Top 0.406: R6.2 68.58,6.35 67.31,5.08 48.26,5.08 45.09,8.26 ROWS.5
R5IN  (via drill 0.61)
  Top 0.305: D14.C D6.C 64.77,39.61 v64.77,39.37 | D22.C D30.C 66.04,29.84 64.77,31.11 v64.77,31.75 | D46.C D38.C 64.77,24.37 v64.77,24.13 | D54.C D62.C 64.77,16.27 v64.77,16.51
  Top 0.406: R6.1 v68.58,11.43
  Bottom 0.305: v64.77,16.51 v64.77,24.13 v64.77,31.75 v64.77,39.37
  Bottom 0.406: v68.58,11.43 67.31,12.7 67.31,13.97 v64.77,16.51
R6
  Top 0.406: R7.2 66.04,6.99 64.77,5.71 48.9,5.71 46.35,8.26 ROWS.6
R6IN  (via drill 0.61)
  Top 0.305: D55.C D63.C 59.69,16.27 v59.69,16.51 | D47.C D39.C 59.69,24.37 v59.69,24.13 | D23.C D31.C 59.69,31.51 v59.69,31.75 | D15.C D7.C 59.69,39.61 v59.69,39.37
  Top 0.406: R7.1 65.41,11.43 v61.59,11.43
  Bottom 0.305: v59.69,16.51 v59.69,24.13 | v59.69,31.75 v59.69,39.37
  Bottom 0.406: v61.59,11.43 59.69,12.7 v59.69,16.51 | v59.69,31.75 v59.69,24.13
R7
  Top 0.406: R8.2 63.5,6.99 62.23,6.35 49.53,6.35 47.62,8.26 ROWS.7
R7IN  (via drill 0.61)
  Top 0.406: R8.1 59.05,9.74 57.78,10.79 56.27,12.06 D64.C 54.61,14.61 53.98,15.88 53.98,19.68 | v58.42,44.45 56.27,43.18 D8.C | D32.C v53.98,29.84 | D24.C 55.24,33.66 53.98,32.38 v53.98,29.84 | D40.C 54.61,26.04 53.98,27.3 | 53.98,27.3 v53.98,29.84 | D48.C 55.24,22.23 53.98,23.5 | 53.98,23.5 53.98,27.3 | D56.C 55.24,18.41 53.98,19.68 | 53.98,19.68 53.98,23.5 | D16.C 54.61,37.47 v53.98,38.1
  Bottom 0.406: 58.42,38.1 58.42,31.75 57.15,29.84 v53.98,29.84 | 58.42,38.1 v58.42,44.45 | v53.98,38.1 58.42,38.1
SER_DATA  (via drill 0.6, 0.61)
  Top 0.305: COLUMNS.14 42.55,46.35 v41.91,46.99 | v20.95,22.86 21.23,23.77 IC1.13 | v27,47 27,45 28.5,43.5 29.07,43.5 U$6.PIN3
  Bottom 0.305: v20.95,22.86 20.95,45.09 22.86,46.99 31.99,46.99 v27,47 v41.9,47 v41.91,46.99
SWCLK  (via drill 0.6)
  Top 0.305: IC1.20 25.79,14.99 24.77,13.97 v24.77,11.43
  Bottom 0.305: v24.77,11.43 27.3,8.89 29.21,8.89 30.48,7.62 ST-LINK.2
SWDIO  (via drill 0.6)
  Top 0.305: IC1.19 25.14,15.61 23.5,13.97 v23.5,11.43
  Bottom 0.305: v23.5,11.43 23.5,10.79 25.4,8.89 ST-LINK.4
VCC  (via drill 0.6, 0.61 pad 0.61, 0.8, 0.8 pad 0.61)
  Top 0.305: v17.14,44.45 v22.12,44.45 | IC1.16 23.18,20.01 22.23,19.05 v17.14,19.05 18.41,17.78 C10.1 | C11.1 5.93,18
  Top 0.406: ROWS.10 v47.62,13.34 | v45.09,42.55 46.99,42.55 47.62,43.81 COLUMNS.10 | C11.1 6,18.28 6,19.8 6.6,20.4 6.6,21 7.2,21.6 9,21.6 9.6,21 | 9.6,21 9.6,20.43 U1.5 | 9.6,21 9.6,21.6 10.2,22.2 11.6,22.2 16.18,17.61 | v36.83,42.55 36.83,42.67 36,43.5 34.53,43.5 U$6.PIN6 | U$6.PIN8 35.1,46.4 37.15,44.35
  Top 0.61: v36.83,42.55 36.83,44.03 37.15,44.35 37.8,45 39.72,45 COLUMNS.16 | ROWS.16 v40.01,19.05
  Top 0.813: v40.01,19.05 34.29,16.51 34.29,8.89 | v17.14,44.45 15.88,46.09 15.8,46.16 C6.1 13.96,46.14 13.96,44.88 13.32,44.24 | v17.14,19.05 16.18,17.61 15.88,17.14 CH340G.4 15.88,8.89 16.51,8.26 19.05,8.26 19.68,6.99 | 19.68,6.99 CH340G.16 | 19.68,6.99 32.38,6.99 34.29,8.89 | ST-LINK.1 34.29,5.08 34.29,8.89 | IC2.2 13.32,44.24 | 13.32,44.24 C7.1
  Bottom 0.305: PRG.2 PRG.1 22.46,43.3 v22.12,44.45
  Bottom 0.406: v40.01,19.05 40.01,14.61 41.27,13.34 v47.62,13.34 | v45.09,42.55 v36.83,42.55 | S1.3 29.25,39.75 27.5,41.5 27.5,43.5 26.5,44.5 22.18,44.5 v22.12,44.45
  Bottom 0.813: v17.14,44.45 v17.14,19.05 | v36.83,42.55 36.83,22.23 v40.01,19.05
VIN  (via drill 0.6)  (1 unrouted)
  Top 0.813: C5.1 8.21,46.14 11.04,43.31 IC2.3 9.53,40.37 9.53,36.52 v6.35,33.02
  Bottom 0.406: CN1.VBUS 5.3,38.2 6.5,37 6.5,33.17 v6.35,33.02
XI
  Top 0.406: C2.1 4.87,5.84 Q1.1 8.13,8.26 11.43,8.26 12.06,8.89 CH340G.7
XO
  Top 0.406: C1.1 4.45,10.38 Q1.2 8.13,9.53 10.16,9.53 10.79,10.16 CH340G.8

### Text on the board
Top: BSidesPR 2016
tPlace: GND | HACKME | B+ | B- | CH340G | NRST | SWDIO | GND | SWCLK | VCC | P / A / R / T / I / C / I / P / A / N / T
bPlace: BATTERY | OFF | B+ | B- | WARNING: / - Do not exceed 5VDC battery / - Battery OFF before / connect PC | To Program: / 1. Connect to PC / 2. Press & Hold Prog / 3. Press & Release Reset | @BSidesPR
tNames: BSIDES | Security | Puerto Rico